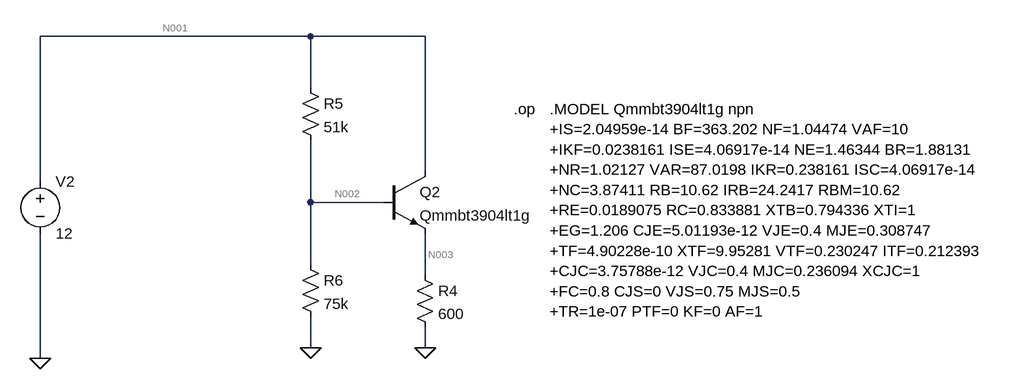
[diagram p0: schematic BJT_biasing.asc]
BJT_biasing.asc, the LTspice schematic file:
Version 4
SHEET 1 2992 1448
WIRE 1344 48 928 48
WIRE 1520 48 1344 48
WIRE 1344 128 1344 48
WIRE 1520 256 1520 48
WIRE 928 272 928 48
WIRE 1344 304 1344 208
WIRE 1456 304 1344 304
WIRE 1344 400 1344 304
WIRE 1520 416 1520 352
WIRE 1344 528 1344 480
WIRE 1520 528 1520 496
WIRE 928 544 928 352
FLAG 1344 528 0
FLAG 928 544 0
FLAG 1520 528 0
SYMBOL npn 1456 256 R0
SYMATTR InstName Q2
SYMATTR Value Qmmbt3904lt1g
SYMBOL res 1504 400 R0
SYMATTR InstName R4
SYMATTR Value 600
SYMBOL res 1328 112 R0
SYMATTR InstName R5
SYMATTR Value 51k
SYMBOL res 1328 384 R0
SYMATTR InstName R6
SYMATTR Value 75k
SYMBOL voltage 928 256 R0
WINDOW 123 0 0 Left 0
WINDOW 39 0 0 Left 0
SYMATTR InstName V2
SYMATTR Value 12
TEXT 1656 160 Left 2 !.op
TEXT 1712 160 Left 2 !.MODEL Qmmbt3904lt1g npn\n+IS=2.04959e-14 BF=363.202 NF=1.04474 VAF=10\n+IKF=0.0238161 ISE=4.06917e-14 NE=1.46344 BR=1.88131\n+NR=1.02127 VAR=87.0198 IKR=0.238161 ISC=4.06917e-14\n+NC=3.87411 RB=10.62 IRB=24.2417 RBM=10.62\n+RE=0.0189075 RC=0.833881 XTB=0.794336 XTI=1\n+EG=1.206 CJE=5.01193e-12 VJE=0.4 MJE=0.308747\n+TF=4.90228e-10 XTF=9.95281 VTF=0.230247 ITF=0.212393\n+CJC=3.75788e-12 VJC=0.4 MJC=0.236094 XCJC=1\n+FC=0.8 CJS=0 VJS=0.75 MJS=0.5\n+TR=1e-07 PTF=0 KF=0 AF=1

The netlist it stands for:
* BJT_biasing.asc
Q2 N001 N002 N003 0 Qmmbt3904lt1g
R4 N003 0 600
R5 N001 N002 51k
R6 N002 0 75k
V2 N001 0 12
.model NPN NPN
.model PNP PNP
.lib standard.bjt
.op
.MODEL Qmmbt3904lt1g npn
+IS=2.04959e-14 BF=363.202 NF=1.04474 VAF=10
+IKF=0.0238161 ISE=4.06917e-14 NE=1.46344 BR=1.88131
+NR=1.02127 VAR=87.0198 IKR=0.238161 ISC=4.06917e-14
+NC=3.87411 RB=10.62 IRB=24.2417 RBM=10.62
+RE=0.0189075 RC=0.833881 XTB=0.794336 XTI=1
+EG=1.206 CJE=5.01193e-12 VJE=0.4 MJE=0.308747
+TF=4.90228e-10 XTF=9.95281 VTF=0.230247 ITF=0.212393
+CJC=3.75788e-12 VJC=0.4 MJC=0.236094 XCJC=1
+FC=0.8 CJS=0 VJS=0.75 MJS=0.5
+TR=1e-07 PTF=0 KF=0 AF=1
.backanno
.end

* Results of the author's LTspice run, read from the files saved beside the schematic
* Operating Point:
*   V(n001) = 12 V
*   V(n002) = 6.302 V
*   V(n003) = 5.582 V
*   Ic(Q2) = 9.275 mA
*   Ib(Q2) = 27.71 µA
*   Ie(Q2) = -9.303 mA
*   I(R6) = 84.02 µA
*   I(R5) = 111.7 µA
*   I(R4) = 9.303 mA
*   I(V2) = -9.387 mA